# Altium schematic sheet powerclocks.SCHDOC
size B
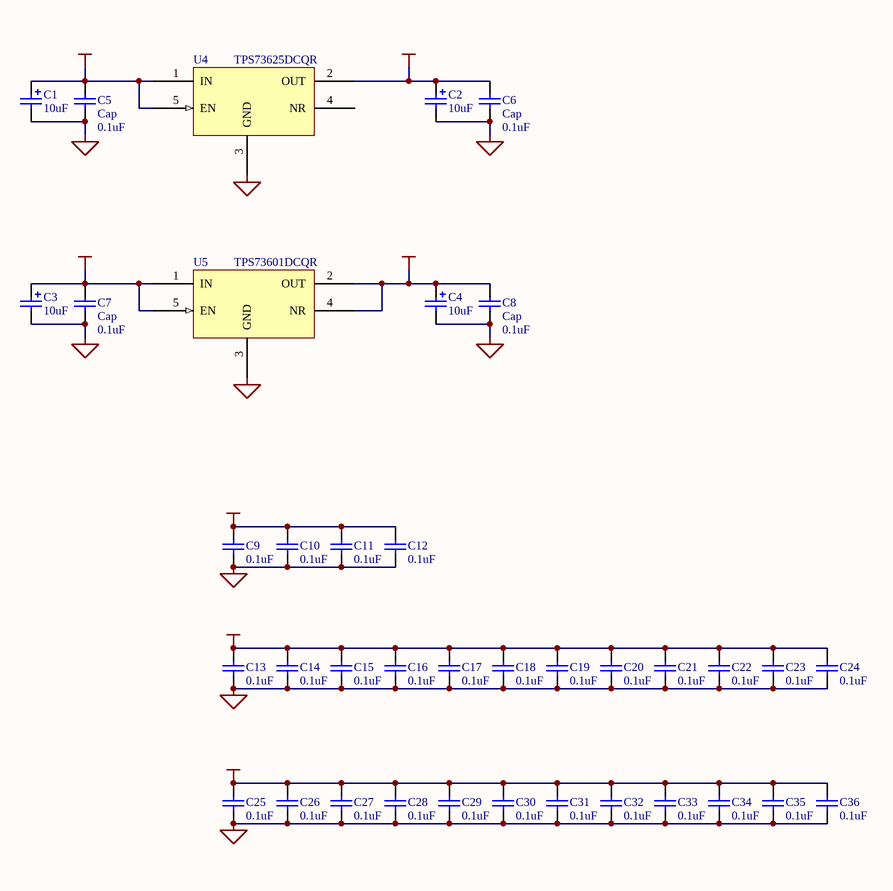
[diagram p0: powerclocks.SCHDOC]

## Parts
C1  value 10uF  [TC7343-2917]  (hidden comment: Cap Pol1)
C2  value 10uF  [TC7343-2917]  (hidden comment: Cap Pol1)
C3  value 10uF  [TC7343-2917]  (hidden comment: Cap Pol1)
C4  value 10uF  [TC7343-2917]  (hidden comment: Cap Pol1)
C5  Cap  value 0.1uF  [CC1608-0603]
C6  Cap  value 0.1uF  [CC1608-0603]
C7  Cap  value 0.1uF  [CC1608-0603]
C8  Cap  value 0.1uF  [CC1608-0603]
C9  value 0.1uF  [CC1608-0603]  (hidden comment: Cap)
C10  value 0.1uF  [CC1608-0603]  (hidden comment: Cap)
C11  value 0.1uF  [CC1608-0603]  (hidden comment: Cap)
C12  value 0.1uF  [CC1608-0603]  (hidden comment: Cap)
C13  value 0.1uF  [CC1608-0603]  (hidden comment: Cap)
C14  value 0.1uF  [CC1608-0603]  (hidden comment: Cap)
C15  value 0.1uF  [CC1608-0603]  (hidden comment: Cap)
C16  value 0.1uF  [CC1608-0603]  (hidden comment: Cap)
C17  value 0.1uF  [CC1608-0603]  (hidden comment: Cap)
C18  value 0.1uF  [CC1608-0603]  (hidden comment: Cap)
C19  value 0.1uF  [CC1608-0603]  (hidden comment: Cap)
C20  value 0.1uF  [CC1608-0603]  (hidden comment: Cap)
C21  value 0.1uF  [CC1608-0603]  (hidden comment: Cap)
C22  value 0.1uF  [CC1608-0603]  (hidden comment: Cap)
C23  value 0.1uF  [CC1608-0603]  (hidden comment: Cap)
C24  value 0.1uF  [CC1608-0603]  (hidden comment: Cap)
C25  value 0.1uF  [CC1608-0603]  (hidden comment: Cap)
C26  value 0.1uF  [CC1608-0603]  (hidden comment: Cap)
C27  value 0.1uF  [CC1608-0603]  (hidden comment: Cap)
C28  value 0.1uF  [CC1608-0603]  (hidden comment: Cap)
C29  value 0.1uF  [CC1608-0603]  (hidden comment: Cap)
C30  value 0.1uF  [CC1608-0603]  (hidden comment: Cap)
C31  value 0.1uF  [CC1608-0603]  (hidden comment: Cap)
C32  value 0.1uF  [CC1608-0603]  (hidden comment: Cap)
C33  value 0.1uF  [CC1608-0603]  (hidden comment: Cap)
C34  value 0.1uF  [CC1608-0603]  (hidden comment: Cap)
C35  value 0.1uF  [CC1608-0603]  (hidden comment: Cap)
C36  value 0.1uF  [CC1608-0603]  (hidden comment: Cap)
U4  TPS73625DCQR  [SOT223-5/Simple]
U5  TPS73601DCQR  [SOT223-5/Simple]

## Nets
+1.2VCC: C4.1 C8.2 C9.2 C10.2 C11.2 C12.2 U5.2(OUT) U5.4(NR)
+2.5VCC: C2.1 C6.2 C13.2 C14.2 C15.2 C16.2 C17.2 C18.2 C19.2 C20.2 C21.2 C22.2 C23.2 C24.2 U4.2(OUT)
GND: C1.2 C2.2 C3.2 C4.2 C5.1 C6.1 C7.1 C8.1 C9.1 C10.1 C11.1 C12.1 C13.1 C14.1 C15.1 C16.1 C17.1 C18.1 C19.1 C20.1 C21.1 C22.1 C23.1 C24.1 C25.1 C26.1 C27.1 C28.1 C29.1 C30.1 C31.1 C32.1 C33.1 C34.1 C35.1 C36.1 U4.3(GND) U5.3(GND)
VCC: C1.1 C3.1 C5.2 C7.2 C25.2 C26.2 C27.2 C28.2 C29.2 C30.2 C31.2 C32.2 C33.2 C34.2 C35.2 C36.2 U4.1(IN) U4.5(EN) U5.1(IN) U5.5(EN)

Not connected (* = marked no-connect by the designer): U4 4(NR)

## Library data of the parts
C1-C4 = Cap Pol1: Polarized Capacitor (Radial); Manufacturer: Generic Components; Class I: Passive; Published: 8-Jun-2000; Revision: July-2002: Re-released for DXP Platform.; Publisher: Altium Limited; Class II: Capacitor
C5-C36 = Cap: Capacitor; Manufacturer: Generic Components; Class I: Passive; Published: 8-Jun-2000; Revision: July-2002: Re-released for DXP Platform.; Publisher: Altium Limited; Class II: Capacitor
U4 U5 = TPS736XX: Cap-free NMOS 400 mA LDO